# Altium schematic sheet 主控.SchDoc
size A4; DocumentNumber: 1; SheetNumber: 1; SheetTotal: 2
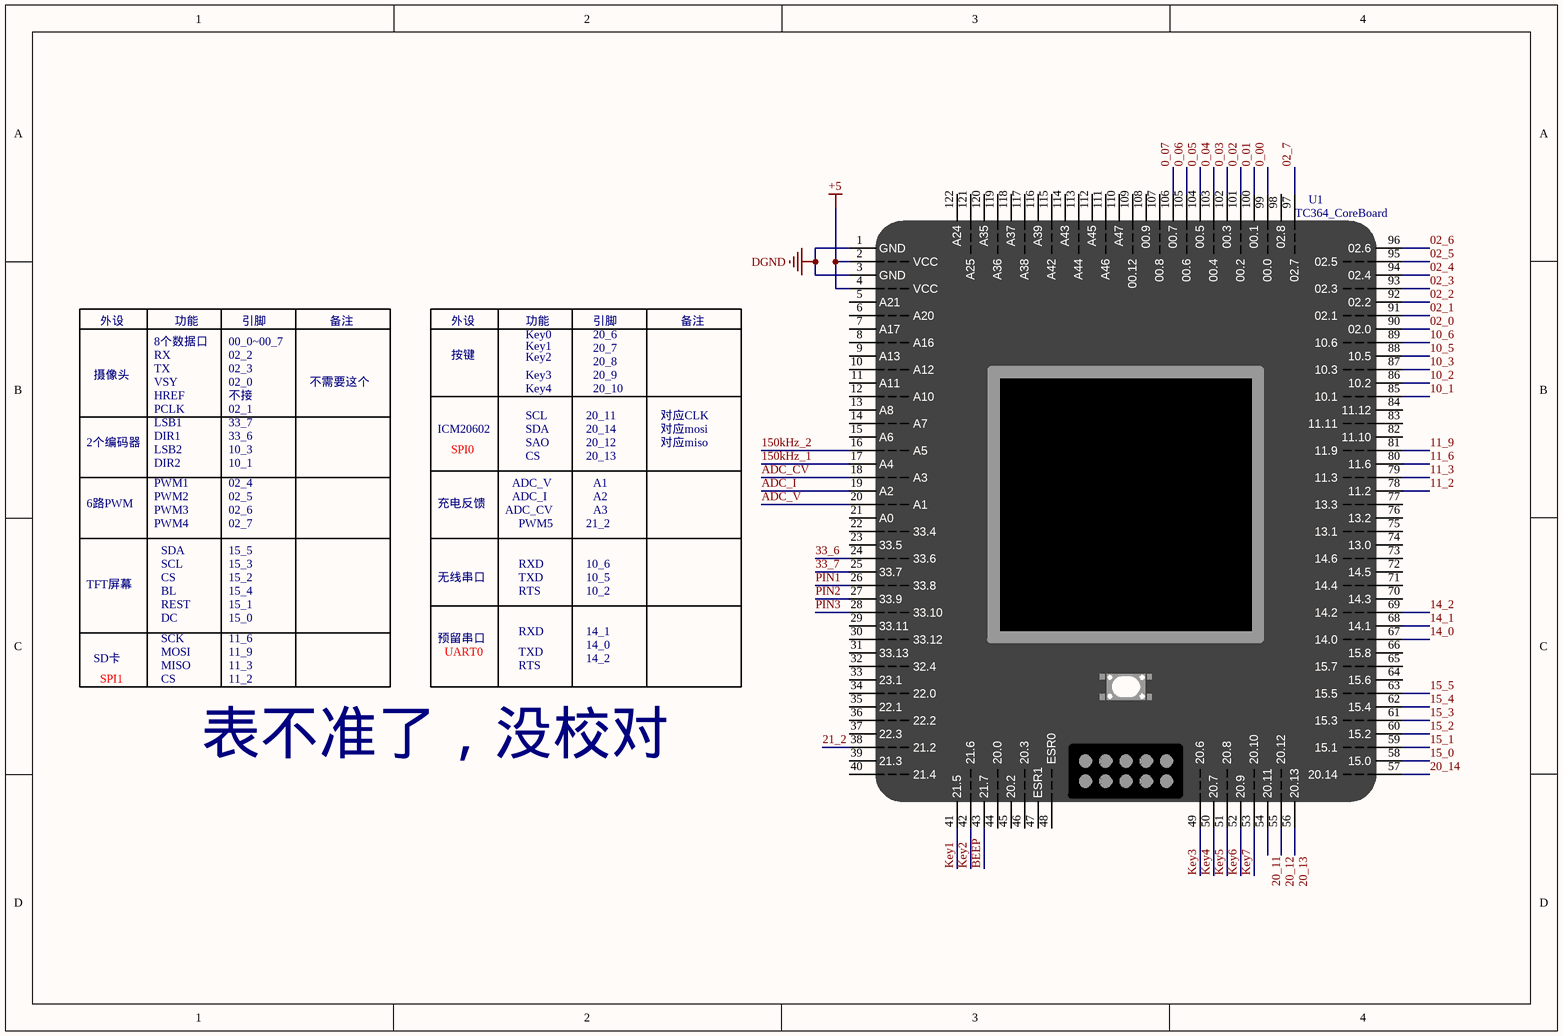
[diagram p0: 主控.SchDoc]

## Parts
U1  TC364_CoreBoard  [TC364_CoreBoard]

## Nets
+5: U1.2(VCC) U1.4(VCC)
DGND: U1.1(GND) U1.3(GND)
0_00: U1.99(00.0)
0_01: U1.100(00.1)
0_02: U1.101(00.2)
0_03: U1.102(00.3)
0_04: U1.103(00.4)
0_05: U1.104(00.5)
0_06: U1.105(00.6)
0_07: U1.106(00.7)
02_0: U1.90(02.0)
02_1: U1.91(02.1)
02_2: U1.92(02.2)
02_3: U1.93(02.3)
02_4: U1.94(02.4)
02_5: U1.95(02.5)
02_6: U1.96(02.6)
02_7: U1.97(02.7)
10_1: U1.85(10.1)
10_2: U1.86(10.2)
10_3: U1.87(10.3)
10_5: U1.88(10.5)
10_6: U1.89(10.6)
11_2: U1.78(11.2)
11_3: U1.79(11.3)
11_6: U1.80(11.6)
11_9: U1.81(11.9)
14_0: U1.67(14.0)
14_1: U1.68(14.1)
14_2: U1.69(14.2)
15_0: U1.58(15.0)
15_1: U1.59(15.1)
15_2: U1.60(15.2)
15_3: U1.61(15.3)
15_4: U1.62(15.4)
15_5: U1.63(15.5)
20_11: U1.54(20.11)
20_12: U1.55(20.12)
20_13: U1.56(20.13)
20_14: U1.57(20.14)
21_2: U1.38(21.2)
33_6: U1.24(33.6)
33_7: U1.25(33.7)
150kHz_1: U1.17(A4)
150kHz_2: U1.16(A5)
ADC_CV: U1.18(A3)
ADC_I: U1.19(A2)
ADC_V: U1.20(A1)
BEEP: U1.43(21.7)
Key1: U1.41(21.5)
Key2: U1.42(21.6)
Key3: U1.49(20.6)
Key4: U1.50(20.7)
Key5: U1.51(20.8)
Key6: U1.52(20.9)
Key7: U1.53(20.10)
PIN1: U1.26(33.8)
PIN2: U1.27(33.9)
PIN3: U1.28(33.10)

Not connected (* = marked no-connect by the designer): U1 5(A21) 6(A20) 7(A17) 8(A16) 9(A13) 10(A12) 11(A11) 12(A10) 13(A8) 14(A7) 15(A6) 21(A0) 22(33.4) 23(33.5) 29(33.11) 30(33.12) 31(33.13) 32(32.4) 33(23.1) 34(22.0) 35(22.1) 36(22.2) 37(22.3) 39(21.3) 40(21.4) 44(20.0) 45(20.2) 46(20.3) 47(ESR1) 48(ESR0) 64(15.6) 65(15.7) 66(15.8) 70(14.3) 71(14.4) 72(14.5) 73(14.6) 74(13.0) 75(13.1) 76(13.2) 77(13.3) 82(11.10) 83(11.11) 84(11.12) 98(02.8) 107(00.8) 108(00.9) 109(00.12) 110(A47) 111(A46) 112(A45) 113(A44) 114(A43) 115(A42) 116(A39) 117(A38) 118(A37) 119(A36) 120(A35) 121(A25) 122(A24)

## Notes on the sheet
- 摄像头
- 外设
- 8个数据口
- RX
- TX
- VSY
- 功能
- 00_0~00_7
- 02_2
- 02_3
- 02_0
- 引脚
- 不需要这个
- 备注
- 按键
- Key0
- Key2
- Key1
- Key3
- 20_9
- 20_8
- 20_7
- 20_6
- 2个编码器
- HREF
- PCLK
- LSB1
- DIR1
- 不接
- 02_1
- 33_7
- 33_6
- ICM20602
- SDA
- SAO
- SCL
- Key4
- 20_11
- 20_14
- 20_12
- 20_10
- 对应CLK
- 对应mosi
- 对应miso
- 6路PWM
- LSB2
- DIR2
- PWM1
- PWM2
- PWM3
- 10_3
- 10_1
- 02_4
- 02_5
- 02_6
- 充电反馈
- SPI0
- ADC_CV
- ADC_V
- ADC_I
- CS
- 20_13
- A1
- A2
- A3
- PWM4
- 15_5
- 15_3
- 15_2
- 02_7
- 无线串口
- PWM5
- TXD
- RXD
- 21_2
- 10_6
- 10_5
- TFT屏幕
- BL
- REST
- DC
- SCK
- MOSI
- 15_4
- 15_1
- 15_0
- 11_6
- 11_9
- 预留串口
- UART0
- RTS
- 10_2
- 14_0
- 14_1
- SD卡
- SPI1
- MISO
- 11_3
- 11_2
- 14_2
- 表不准了，没校对

## Library data of the parts
U1 = TC364_CoreBoard: 逐飞科技TC364核心板